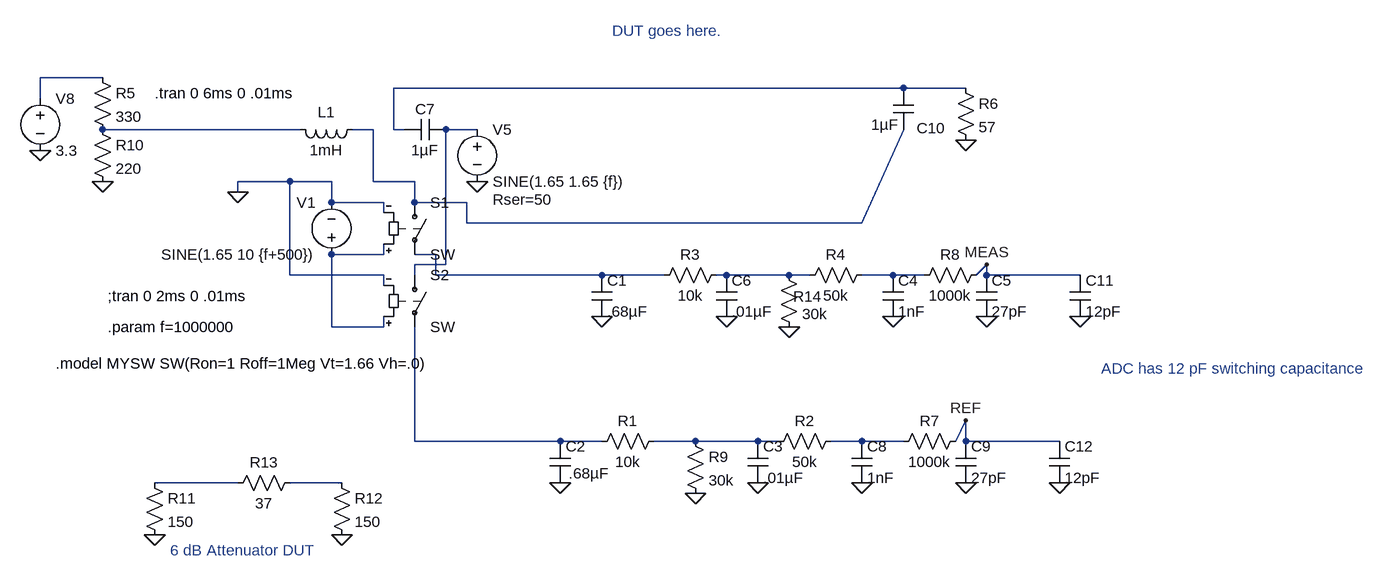
[diagram p0: schematic VNA2018NewLPF.asc]
VNA2018NewLPF.asc, the LTspice schematic file:
Version 4
SHEET 1 1568 888
WIRE -400 -96 -496 -96
WIRE 832 -80 48 -80
WIRE 928 -80 832 -80
WIRE -496 -64 -496 -96
WIRE -96 -16 -400 -16
WIRE 16 -16 -16 -16
WIRE 48 -16 48 -80
WIRE 64 -16 48 -16
WIRE 176 -16 128 -16
WIRE -112 64 -192 64
WIRE -48 64 -112 64
WIRE 16 64 16 -16
WIRE 80 64 16 64
WIRE -192 80 -192 64
WIRE -48 96 -48 64
WIRE 32 96 -48 96
WIRE 80 96 80 64
WIRE 160 96 80 96
WIRE 32 112 32 96
WIRE 160 128 160 96
WIRE 768 128 832 -16
WIRE 768 128 160 128
WIRE 32 176 32 160
WIRE 32 176 -48 176
WIRE 112 176 80 176
WIRE 128 192 128 -16
WIRE 128 192 80 192
WIRE -112 208 -112 64
WIRE 32 208 -112 208
WIRE 80 208 80 192
WIRE 112 208 112 176
WIRE 368 208 112 208
WIRE 464 208 368 208
WIRE 560 208 544 208
WIRE 656 208 560 208
WIRE 688 208 656 208
WIRE 816 208 768 208
WIRE 864 208 816 208
WIRE 944 208 960 192
WIRE 960 208 960 192
WIRE 1104 208 960 208
WIRE 32 224 32 208
WIRE -48 288 -48 176
WIRE 32 288 32 272
WIRE 32 288 -48 288
WIRE 80 464 80 288
WIRE 304 464 80 464
WIRE 368 464 304 464
WIRE 512 464 448 464
WIRE 608 464 512 464
WIRE 640 464 608 464
WIRE 768 464 720 464
WIRE 832 464 768 464
WIRE 912 464 928 432
WIRE 928 464 928 432
WIRE 1072 464 928 464
WIRE -192 528 -320 528
WIRE -32 528 -112 528
FLAG 176 64 0
FLAG -192 80 0
FLAG -496 16 0
FLAG 368 272 0
FLAG 608 528 0
FLAG 768 528 0
FLAG 928 528 0
FLAG 816 272 0
FLAG 960 272 0
FLAG 560 272 0
FLAG 960 192 MEAS
FLAG 928 432 REF
FLAG -400 64 0
FLAG -32 608 0
FLAG -320 608 0
FLAG 928 0 0
FLAG 512 544 0
FLAG 656 288 0
FLAG 1104 272 0
FLAG 1072 528 0
FLAG 304 528 0
SYMBOL sw 80 80 R0
SYMATTR InstName S1
SYMATTR SpiceModel MYSW
SYMBOL sw 80 192 R0
SYMATTR InstName S2
SYMATTR SpiceModel MYSW
SYMBOL voltage -48 192 R180
WINDOW 0 24 96 Left 2
WINDOW 3 24 16 Left 2
WINDOW 123 0 0 Left 2
WINDOW 39 0 0 Left 2
SYMATTR InstName V1
SYMATTR Value SINE(1.65 10 {f+500})
SYMBOL cap 352 208 R0
SYMATTR InstName C1
SYMATTR Value .68µF
SYMBOL cap 288 464 R0
WINDOW 3 29 49 Left 2
SYMATTR Value .68µF
SYMATTR InstName C2
SYMBOL voltage 176 -32 R0
WINDOW 123 0 0 Left 2
WINDOW 39 24 124 Left 2
SYMATTR SpiceLine Rser=50
SYMATTR InstName V5
SYMATTR Value SINE(1.65 1.65 {f})
SYMBOL res 464 448 R90
WINDOW 0 0 56 VBottom 2
WINDOW 3 32 56 VTop 2
SYMATTR InstName R1
SYMATTR Value 10k
SYMBOL res 560 192 R90
WINDOW 0 0 56 VBottom 2
WINDOW 3 32 56 VTop 2
SYMATTR InstName R3
SYMATTR Value 10k
SYMBOL voltage -496 -80 R0
WINDOW 123 0 0 Left 2
WINDOW 39 0 0 Left 2
SYMATTR InstName V8
SYMATTR Value 3.3
SYMBOL res -416 -112 R0
SYMATTR InstName R5
SYMATTR Value 330
SYMBOL cap 128 -32 R90
WINDOW 0 0 32 VBottom 2
WINDOW 3 32 32 VTop 2
SYMATTR InstName C7
SYMATTR Value 1µF
SYMBOL ind 0 -32 R90
WINDOW 0 5 56 VBottom 2
WINDOW 3 32 56 VTop 2
SYMATTR InstName L1
SYMATTR Value 1mH
SYMATTR SpiceLine Ipk=0.43 Rser=2.58 Rpar=94200 Cpar=0
SYMBOL cap 752 464 R0
SYMATTR InstName C8
SYMATTR Value 1nF
SYMBOL cap 912 464 R0
SYMATTR InstName C9
SYMATTR Value 27pF
SYMBOL res 736 448 R90
WINDOW 0 0 56 VBottom 2
WINDOW 3 32 56 VTop 2
SYMATTR InstName R2
SYMATTR Value 50k
SYMBOL res 928 448 R90
WINDOW 0 0 56 VBottom 2
WINDOW 3 32 56 VTop 2
SYMATTR InstName R7
SYMATTR Value 1000k
SYMBOL cap 800 208 R0
SYMATTR InstName C4
SYMATTR Value 1nF
SYMBOL cap 944 208 R0
SYMATTR InstName C5
SYMATTR Value 27pF
SYMBOL res 784 192 R90
WINDOW 0 0 56 VBottom 2
WINDOW 3 32 56 VTop 2
SYMATTR InstName R4
SYMATTR Value 50k
SYMBOL res 960 192 R90
WINDOW 0 0 56 VBottom 2
WINDOW 3 32 56 VTop 2
SYMATTR InstName R8
SYMATTR Value 1000k
SYMBOL cap 544 208 R0
SYMATTR InstName C6
SYMATTR Value .01µF
SYMBOL cap 592 464 R0
SYMATTR InstName C3
SYMATTR Value .01µF
SYMBOL res -416 -32 R0
SYMATTR InstName R10
SYMATTR Value 220
SYMBOL res -336 512 R0
SYMATTR InstName R11
SYMATTR Value 150
SYMBOL res -48 512 R0
SYMATTR InstName R12
SYMATTR Value 150
SYMBOL res -96 512 R90
WINDOW 0 0 56 VBottom 2
WINDOW 3 32 56 VTop 2
SYMATTR InstName R13
SYMATTR Value 37
SYMBOL cap 848 -16 R180
WINDOW 0 -49 2 Left 2
WINDOW 3 24 8 Left 2
SYMATTR InstName C10
SYMATTR Value 1µF
SYMBOL res 912 -96 R0
SYMATTR InstName R6
SYMATTR Value 57
SYMBOL res 496 448 R0
SYMATTR InstName R9
SYMATTR Value 30k
SYMBOL res 640 192 R0
WINDOW 0 22 49 Left 2
SYMATTR InstName R14
SYMATTR Value 30k
SYMBOL cap 1088 208 R0
SYMATTR InstName C11
SYMATTR Value 12pF
SYMBOL cap 1056 464 R0
SYMATTR InstName C12
SYMATTR Value 12pF
TEXT -320 -72 Left 2 !.tran 0 6ms 0 .01ms
TEXT -392 240 Left 2 !;tran 0 2ms 0 .01ms
TEXT 384 -168 Left 2 ;DUT goes here.
TEXT -392 288 Left 2 !.param f=1000000
TEXT -472 344 Left 2 !.model MYSW SW(Ron=1 Roff=1Meg Vt=1.66 Vh=.0)
TEXT -296 632 Left 2 ;6 dB Attenuator DUT
TEXT 1136 352 Left 2 ;ADC has 12 pF switching capacitance

The netlist it stands for:
* VNA2018NewLPF.asc
S1 N004 N007 N006 0 MYSW SW
S2 N005 N010 N006 0 MYSW SW
V1 N006 0 SINE(1.65 10 {f+500})
C1 N007 0 .68µF
C2 N010 0 .68µF
V5 N005 0 SINE(1.65 1.65 {f}) Rser=50
R1 N011 N010 10k
R3 N008 N007 10k
V8 N001 0 3.3
R5 N001 N003 330
C7 N005 N002 1µF
L1 N004 N003 1mH Ipk=0.43 Rser=2.58 Rpar=94200 Cpar=0
C8 N012 0 1nF
C9 REF 0 27pF
R2 N012 N011 50k
R7 REF N012 1000k
C4 N009 0 1nF
C5 MEAS 0 27pF
R4 N009 N008 50k
R8 MEAS N009 1000k
C6 N008 0 .01µF
C3 N011 0 .01µF
R10 N003 0 220
R11 N013 0 150
R12 N014 0 150
R13 N014 N013 37
C10 N004 N002 1µF
R6 N002 0 57
R9 N011 0 30k
R14 N008 0 30k
C11 MEAS 0 12pF
C12 REF 0 12pF
.tran 0 6ms 0 .01ms
;tran 0 2ms 0 .01ms
* DUT goes here.
.param f=1000000
.model MYSW SW(Ron=1 Roff=1Meg Vt=1.66 Vh=.0)
* 6 dB Attenuator DUT
* ADC has 12 pF switching capacitance
.backanno
.end